# EAGLE design ESP8266ModuleEV1 (EAGLE 9.3.0)
COMPANY: ADAFRUIT INDUSTRIES; DRAWN: KTOWN; REV: A
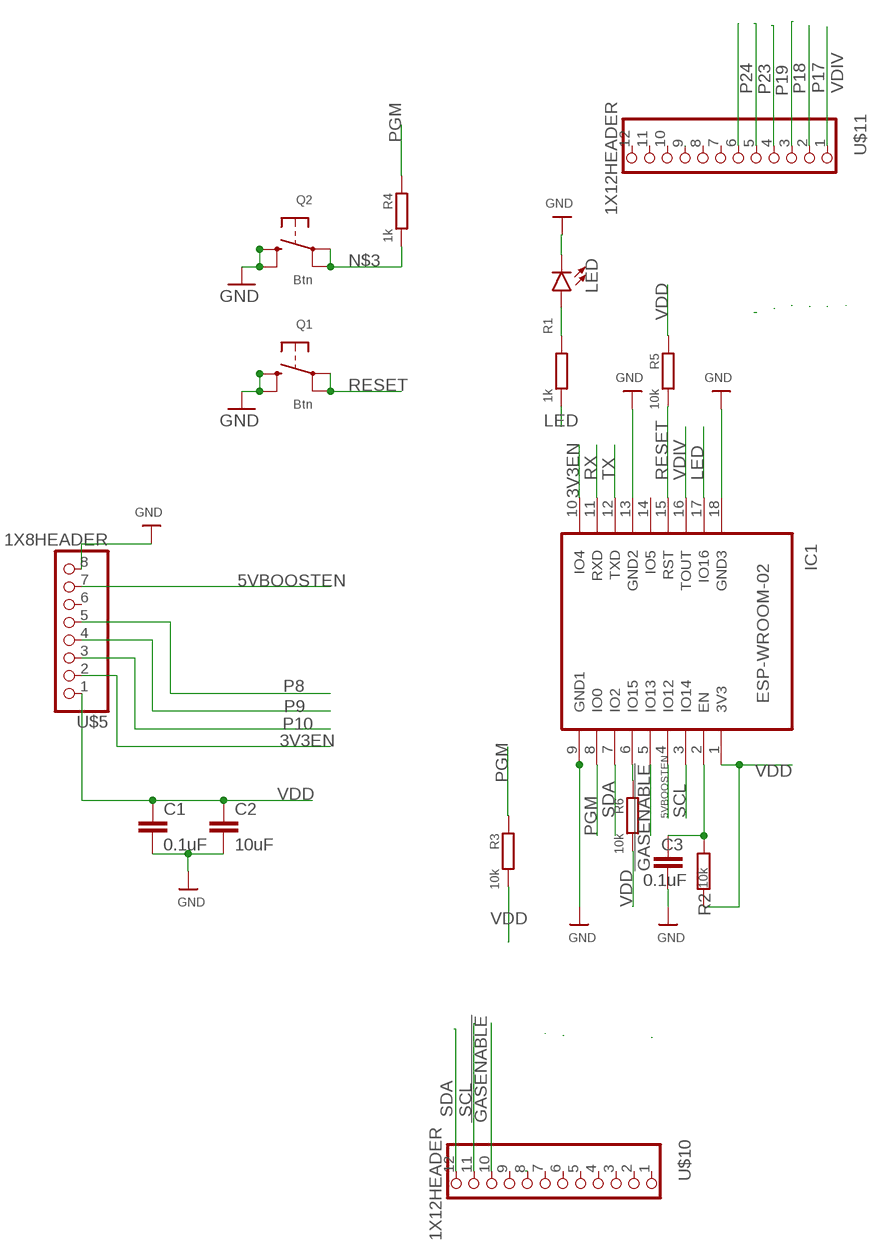
[diagram p0: schematic, sheet 1]

## Parts
C1  0.1uF  CAPACITOR_0402_N  [RESC0402_N]
C2  10uF  CAPACITOR_0402_N  [RESC0402_N]
C3  0.1uF  CAPACITOR_0402_N  [RESC0402_N]
IC1  ESP-WROOM-02  [ESP-WROOM-02]
LED  LED0603  [LED-0603]
Q1  Btn  SWITCH_TACT_SMT4.6X2.8  [BTN_KMR2_4.6X2.8]
Q2  Btn  SWITCH_TACT_SMT4.6X2.8  [BTN_KMR2_4.6X2.8]
R1  1k  RESR0402  [R0402]
R2  10k  RESISTOR_0402_N  [RESC0402_N]
R3  10k  RESR0402  [R0402]
R4  1k  RESR0402  [R0402]
R5  10k  RESR0402  [R0402]
R6  10k  RESR0402  [R0402]
U$5  1X8HEADER  [8X1]
U$10  1X12HEADER  [1X12]
U$11  1X12HEADER  [1X12]

## Nets
3V3EN: IC1.10(IO4) U$5.2
5VBOOSTEN: IC1.4(IO12) U$5.7
!GASENABLE: IC1.5(IO13) U$10.10
GND: C1.2 C2.2 C3.2 IC1.9(GND1) IC1.13(GND2) IC1.18(GND3) IC1.19(GND0) LED.C Q1.B'(S1) Q1.B(S) Q2.B'(S1) Q2.B(S) U$5.8
LED: IC1.17(IO16) R1.2
N$1: C3.1 IC1.2(EN) R2.2
N$2: IC1.6(IO15) R6.1
N$3: Q2.A'(P1) Q2.A(P) R4.2
N$5: LED.A R1.1
P8: U$5.5
P9: U$5.4
P10: U$5.3
P17: U$11.2
P18: U$11.3
P19: U$11.4
P23: U$11.5
P24: U$11.6
P29: U$10.8
PGM: IC1.8(IO0) R3.1 R4.1
RESET: IC1.15(RST) Q1.A'(P1) Q1.A(P) R5.2
RX: IC1.11(RXD)
SCL: IC1.3(IO14) U$10.11
SDA: IC1.7(IO2) U$10.12
SIM1V8: U$11.9
TX: IC1.12(TXD)
VDD: C1.1 C2.1 IC1.1(3V3) R2.1 R3.2 R5.1 R6.2 U$5.1
VDIV: IC1.16(TOUT) U$11.1
Unconnected: IC1.14(IO5) U$5.6 U$10.1 U$10.2 U$10.3 U$10.4 U$10.5 U$10.6 U$10.7 U$10.9 U$11.7 U$11.8 U$11.10 U$11.11 U$11.12

## Library data of the parts
C1-C3 = NordicMisc:CAPACITOR: Generic chip capacitor
IC1 = esp-wroom-02:ESP-WROOM-02: WiFi module - ESP-WROOM-02
LED = SparkFun-LED:LED: LED (Generic) Standard schematic elements and footprints for 5mm, 3mm, 1206, and 0603 sized LEDs. Generic LEDs with no color specified.
Q1 Q2 = microbuilder:SWITCH_TACT_SMT: SMT Tact Switches 6x6mm - Digikey: P12940SCT-ND KMR2 (4.6x2.8mm) - Digikey: 401-1426-1-ND EVQ-PQHB55 - Light Touch, 160GF (4.5x4.5mm) - Digikey: P8090SCT-ND KMT0 - KMT021 NGJ LHS (etc.) IP68/Waterproof - Digikey: CKN10289CT-ND
R1 R3-R6 = 1RedBeard:RES: RES
R2 = NordicMisc:RESISTOR: Generic chip resistor
U$5 = Headers:1X8HEADER
U$10 U$11 = Headers:1X12HEADER

## Board
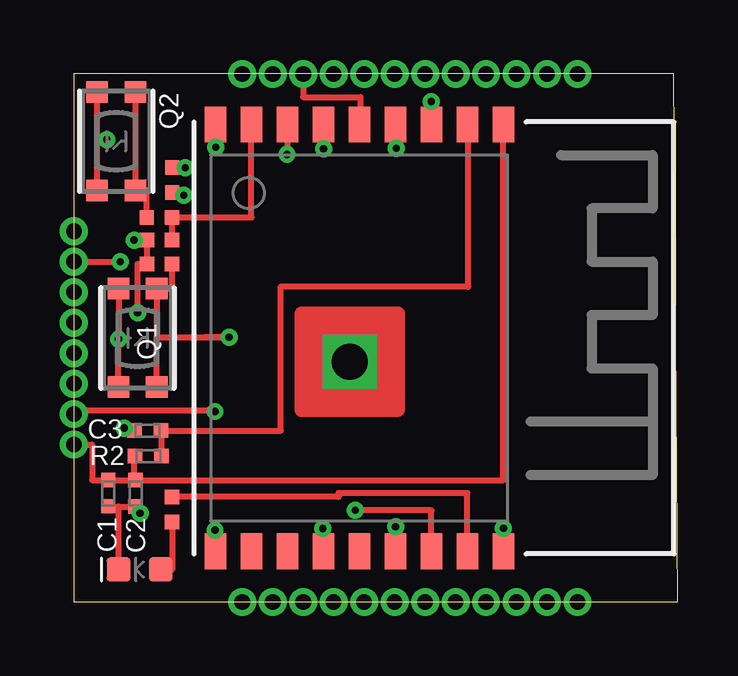
[diagram p1: board, top side]
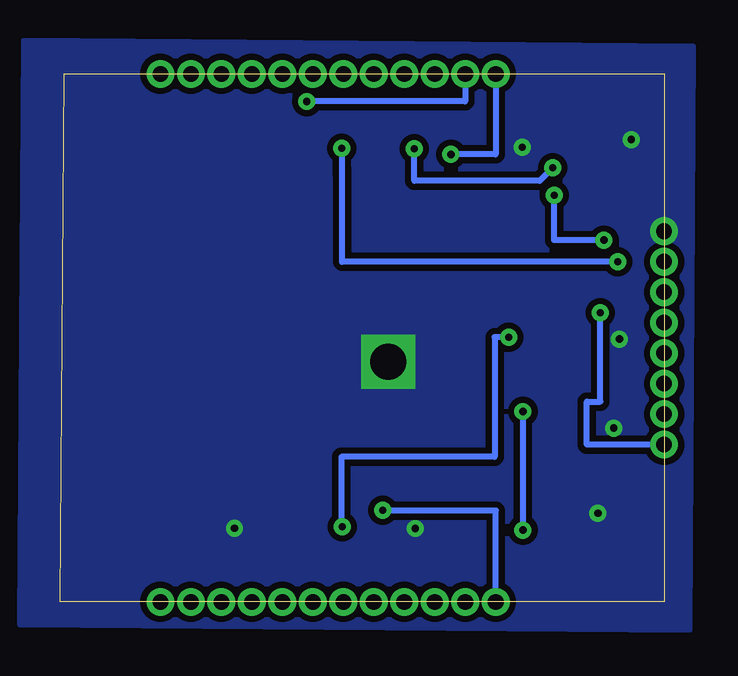
[diagram p2: board, bottom side, seen from below]

Size 25.17 x 22 mm. Coordinates in mm from the lower left corner, seen from the top.
Outline: 25,22 0,22 0,0 25.17,0 25,22
Copper layers (1*16): Top 0.035mm / dielectric 1.5mm / Bottom 0.035mm
Design rules "adafruit *": minimum track width 6mil, minimum drill 0.3mm, track to track 8mil, track to pad 8mil, pad to pad 8mil, via to via 8mil, smd to smd 0mil, copper to edge 0mil, drill to drill 8mil, minimum pad ring 10mil, minimum via ring 8mil, stop-mask expansion 2mil, vias tented up to drill 20mil, thermal gap 10mil
tRestrict: area 22.9,7.9 to 23.1,8.3; area 24.9,12.1 to 25,12.4; area 24.3,12.1 to 24.4,12.4

### Footprints (pad centres in the part's own frame; a part is rotated, then mirrored left to right if it is on the bottom)
RESC0402_N = smd 0.6 x 0.6: 1 -0.55,0; 2 0.55,0
ESP-WROOM-02 = smd 1.485 x 0.9: 1 -8.893,4.9; 2 -8.893,3.4; 3 -8.893,1.9; 4 -8.893,0.4; 5 -8.893,-1.1; 6 -8.893,-2.6; 7 -8.893,-4.1; 8 -8.893,-5.6; 9 -8.893,-7.1; 10 8.893,-7.1; 11 8.893,-5.6; 12 8.893,-4.1; 13 8.893,-2.6; 14 8.893,-1.1; 15 8.893,0.4; 16 8.893,1.9; 17 8.893,3.4; 18 8.893,4.9 | drill 1.5 pad 2 square: 19 1,-1.5
LED-0603 = smd 1 x 1: A -0.877,0; C 0.877,0
BTN_KMR2_4.6X2.8 = smd 0.9 x 0.9: A 2.05,0.8; A' -2.05,0.8; B 2.05,-0.8; B' -2.05,-0.8
R0402 = smd 0.6 x 0.6: 1 -0.525,0; 2 0.525,0
8X1 = drill 0.65: 1 -4.445,0; 2 -3.175,0; 3 -1.905,0; 4 -0.635,0; 5 0.635,0; 6 1.905,0; 7 3.175,0; 8 4.445,0
1X12 = drill 0.65: 1 -6.985,0; 2 -5.715,0; 3 -4.445,0; 4 -3.175,0; 5 -1.905,0; 6 -0.635,0; 7 0.635,0; 8 1.905,0; 9 3.175,0; 10 4.445,0; 11 5.715,0; 12 6.985,0

### Placement (x,y rotation side)
C1  1.43,4.54 270 top
C2  2.57,4.52 270 top
C3  3.08,7.14 180 top
IC1  13,11 270 top
LED  2.74,1.35 180 top
Q1  2.65,11 270 top
Q2  1.76,19.19 270 top
R1  4.09,3.85 90 top
R2  3.1,6.08 0 top
R3  3.56,15.07 180 top
R4  3.56,16.02 180 top
R5  3.57,14.08 0 top
R6  4.1,17.58 270 top
U$5  0,11 90 top
U$10  14,22 180 top
U$11  14,0 0 top

### Tracks (layer width: path | path; a pad name or v marks a point on that pad's centre or on a via)
3V3EN  (via drill 0.3)
  Top 0.254: IC1.10 5.9,2.99 v5.88,2.99 | U$5.2 0.14,7.96 5.85,7.96 v5.88,7.93
  Bottom 0.254: v5.88,7.93 v5.88,2.99 | v5.88,2.99
5VBOOSTEN  (via drill 0.3)
  Top 0.254: v13.43,18.9 13.43,19.89 IC1.4 | U$5.7 v1.93,14.18 v1.93,14.17
  Bottom 0.254: 13.41,17.82 13.41,18.03 | v13.43,18.9 13.43,17.82 13.41,17.82 | v1.93,14.17 13.41,14.17 13.41,17.82
!GASENABLE
  Top 0.254: U$10.10 9.55,21.03 11.94,21.03 11.94,19.89 IC1.5
GND  (via drill 0.3)
  Top 0.254: IC1.9 v5.9,18.95 v5.91,18.94 | v17.9,3.07 IC1.18 | v10.37,3.06 10.37,2.14 IC1.13 | v2.09,7.24 2.42,7.24 C3.2 | Q1.B' v1.86,10.95 v1.85,10.95 Q1.B | C1.2 1.43,3.97 1.86,3.97 | 1.86,3.97 C2.2 2.57,3.69 v2.76,3.69 | LED.C 1.86,3.97 | Q2.B' 0.96,19.26 | 0.96,19.26 Q2.B | v1.37,19.26 0.96,19.26
  pour Bottom (isolate 0.254, no thermals): -1.22,23.14 26.69,23.38 26.84,-0.94 -1.07,-1.17
LED
  Top 0.254: R1.2 11.03,4.37 11.03,4.53 16.4,4.53 IC1.17
N$1
  Top 0.254: R2.2 3.63,6.08 C3.1 8.62,7.14 8.62,13.15 16.42,13.15 | 16.42,13.15 16.42,13.13 | 16.42,13.15 16.42,19.89 IC1.2
N$2  (via drill 0.3)
  Top 0.254: R6.1 4.64,18.1 v4.64,18.09 | IC1.6 v10.4,18.88
  Bottom 0.254: v4.64,18.09 5.18,17.54 10.4,17.54 v10.4,18.88
N$3
  Top 0.254: Q2.A' Q2.A 3.04,17.14 R4.2
N$5
  Top 0.254: R1.1 4.09,1.35 LED.A
PGM
  Top 0.254: IC1.8 7.4,16.02 R4.1 R3.1
RESET  (via drill 0.3)
  Top 0.254: 5.47,11.03 v6.47,11.03 3.45,11.03 | Q1.A 3.45,11.03 | v13.4,3.13 IC1.15 | R5.2 4.09,13.05 Q1.A' 3.45,11.03
  Bottom 0.254: v6.47,11.03 7.06,11.03 7.06,6.04 13.44,6.04 13.44,3.13 v13.4,3.13
SCL  (via drill 0.3)
  Top 0.254: v14.89,20.85 IC1.3
  Bottom 0.254: U$10.11 8.29,20.85 v14.89,20.85
SDA  (via drill 0.3)
  Top 0.254: IC1.7 8.9,18.64 v8.88,18.64
  Bottom 0.254: U$10.12 7.01,18.64 v8.88,18.64
VDD  (via drill 0.3)
  Top 0.254: IC1.1 17.9,5.07 C2.1 | 1.43,5.12 C1.1 | 1.43,5.07 C1.1 | C1.1 1.43,5.07 C2.1 | R2.1 2.49,6.02 2.49,5.07 C2.1 | U$5.1 0.76,6.55 0.76,5.08 1.43,5.08 C1.1 | v2.5,15.08 R3.2 R5.1 | R5.1 | R6.2 4.58,17.05 v4.58,16.94 | v2.65,12.05 2.65,14.08 R5.1
  Bottom 0.254: 2.5,15.1 v2.5,15.08 4.58,15.08 v4.58,16.94 | v2.65,12.05 2.65,8.35 3.21,8.35 3.21,6.55 U$5.1
VDIV  (via drill 0.3)
  Top 0.254: IC1.16 14.9,3.82 v11.72,3.82
  Bottom 0.254: v11.72,3.82 11.71,3.8 7,3.8 U$11.1